# Altium schematic sheet mach giua ben trai.SchDoc
size A; SheetNumber: 1; SheetTotal: 1
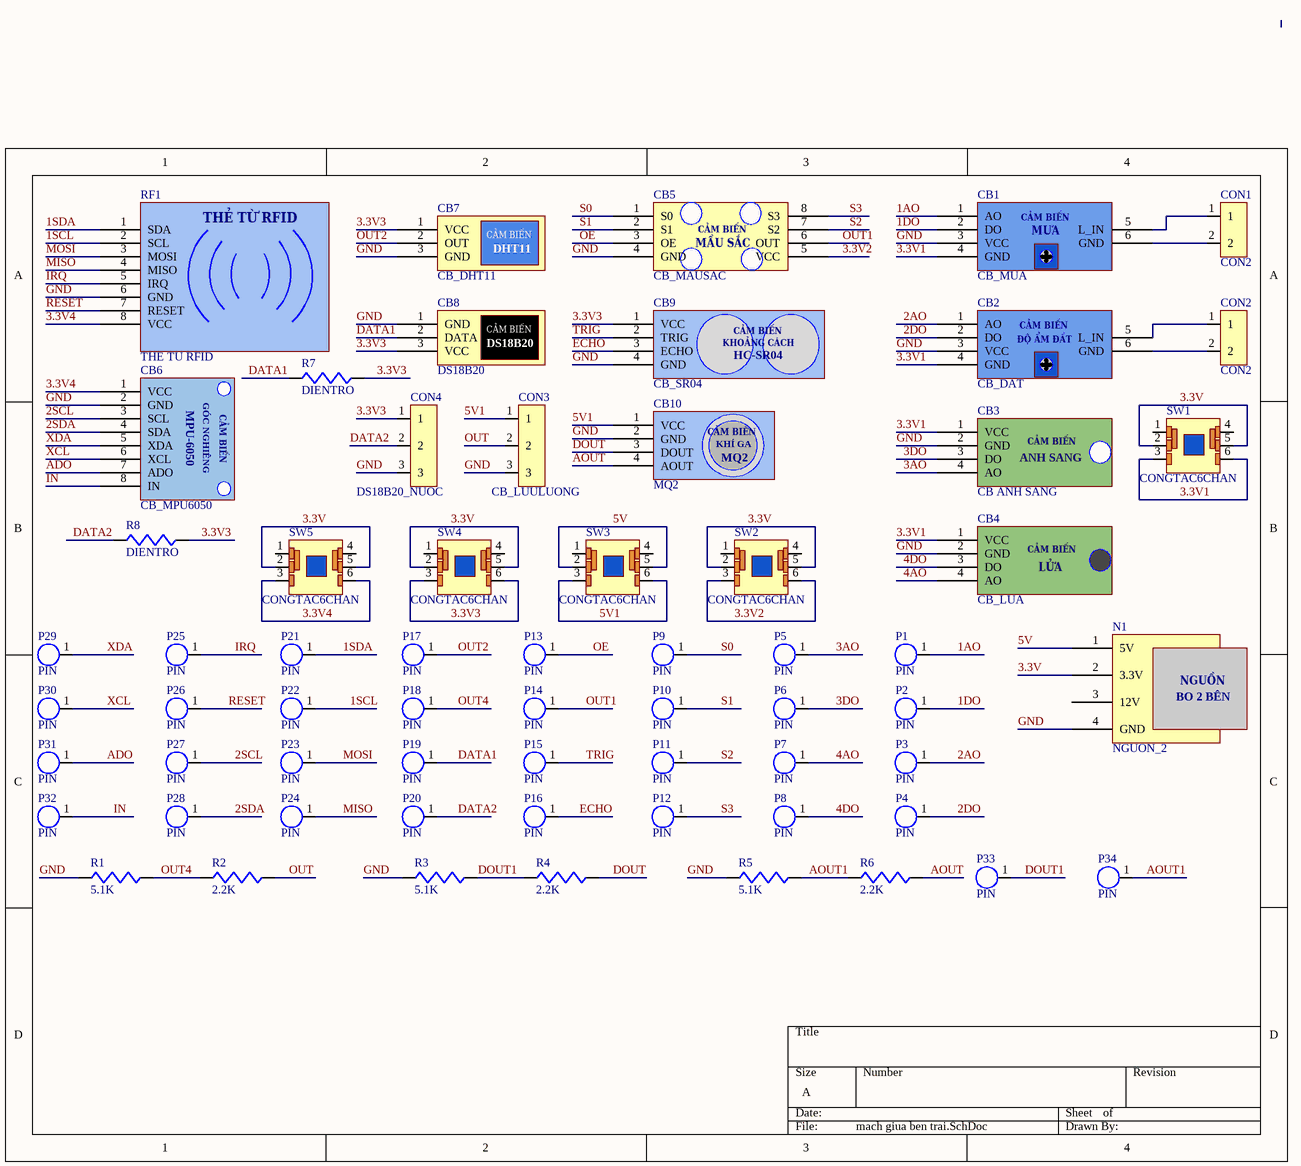
[diagram p0: mach giua ben trai.SchDoc]

## Parts
CB1  CB_MUA  [CB_MUA]
CB2  CB_DAT  [CB_MUA]
CB3  CB ANH SANG  [CB ANH SANG]
CB4  CB_LUA  [CB_LUA]
CB5  CB_MAUSAC  [CB_MAUSAC]
CB6  CB_MPU6050  [CB_MPU6050]
CB7  CB_DHT11  [CB_DHT11]
CB8  DS18B20  [DS18B20]
CB9  CB_SR04  [CB_SR04]
CB10  MQ2  [MQ2]
CON1  CON2  [CON2]
CON2  CON2  [CON2]
CON3  CB_LUULUONG  [CON3]
CON4  DS18B20_NUOC  [CON3]
N1  NGUON_2  [NGUON_2]
P1  PIN  [PIN1]
P2  PIN  [PIN1]
P3  PIN  [PIN1]
P4  PIN  [PIN1]
P5  PIN  [PIN1]
P6  PIN  [PIN1]
P7  PIN  [PIN1]
P8  PIN  [PIN1]
P9  PIN  [PIN1]
P10  PIN  [PIN1]
P11  PIN  [PIN1]
P12  PIN  [PIN1]
P13  PIN  [PIN1]
P14  PIN  [PIN1]
P15  PIN  [PIN1]
P16  PIN  [PIN1]
P17  PIN  [PIN1]
P18  PIN  [PIN1]
P19  PIN  [PIN1]
P20  PIN  [PIN1]
P21  PIN  [PIN1]
P22  PIN  [PIN1]
P23  PIN  [PIN1]
P24  PIN  [PIN1]
P25  PIN  [PIN1]
P26  PIN  [PIN1]
P27  PIN  [PIN1]
P28  PIN  [PIN1]
P29  PIN  [PIN1]
P30  PIN  [PIN1]
P31  PIN  [PIN1]
P32  PIN  [PIN1]
P33  PIN  [PIN1]
P34  PIN  [PIN1]
R1  5.1K  [DIENTRO]
R2  2.2K  [DIENTRO]
R3  5.1K  [DIENTRO]
R4  2.2K  [DIENTRO]
R5  5.1K  [DIENTRO]
R6  2.2K  [DIENTRO]
R7  DIENTRO  [DIENTRO]
R8  DIENTRO  [DIENTRO]
RF1  THE TU RFID  [THE TU RFID]
SW1  CONGTAC6CHAN  [CONGTAC6CHAN]
SW2  CONGTAC6CHAN  [CONGTAC6CHAN]
SW3  CONGTAC6CHAN  [CONGTAC6CHAN]
SW4  CONGTAC6CHAN  [CONGTAC6CHAN]
SW5  CONGTAC6CHAN  [CONGTAC6CHAN]

## Nets
1AO: CB1.1(AO) P1.1
1DO: CB1.2(DO) P2.1
1SCL: P22.1 RF1.2(SCL)
1SDA: P21.1 RF1.1(SDA)
2AO: CB2.1(AO) P3.1
2DO: CB2.2(DO) P4.1
2SCL: CB6.3(SCL) P27.1
2SDA: CB6.4(SDA) P28.1
3.3V: N1.2(3.3V) SW1.2 SW1.5 SW2.2 SW2.5 SW4.2 SW4.5 SW5.2 SW5.5
3.3V1: CB1.4(GND) CB2.4(GND) CB3.1(VCC) CB4.1(VCC) SW1.3 SW1.6
3.3V2: CB5.5(VCC) SW2.3 SW2.6
3.3V3: CB7.1(VCC) CB8.3(VCC) CB9.1(VCC) CON4.1 R7.2 R8.2 SW4.3 SW4.6
3.3V4: CB6.1(VCC) RF1.8(VCC) SW5.3 SW5.6
3AO: CB3.4(AO) P5.1
3DO: CB3.3(DO) P6.1
4AO: CB4.4(AO) P7.1
4DO: CB4.3(DO) P8.1
5V: N1.1(5V) SW3.2 SW3.5
5V1: CB10.1(VCC) CON3.1 SW3.3 SW3.6
ADO: CB6.7(ADO) P31.1
AOUT: CB10.4(AOUT) R6.2
AOUT1: P34.1 R5.2 R6.1
DATA1: CB8.2(DATA) P19.1 R7.1
DATA2: CON4.2 P20.1 R8.1
DOUT: CB10.3(DOUT) R4.2
DOUT1: P33.1 R3.2 R4.1
ECHO: CB9.3(ECHO) P16.1
GND: CB1.3(VCC) CB2.3(VCC) CB3.2(GND) CB4.2(GND) CB5.4(GND) CB6.2(GND) CB7.3(GND) CB8.1(GND) CB9.4(GND) CB10.2(GND) CON3.3 CON4.3 N1.4(GND) R1.1 R3.1 R5.1 RF1.6(GND)
IN: CB6.8(IN) P32.1
IRQ: P25.1 RF1.5(IRQ)
MISO: P24.1 RF1.4(MISO)
MOSI: P23.1 RF1.3(MOSI)
OE: CB5.3(OE) P13.1
OUT: CON3.2 R2.2
OUT1: CB5.6(OUT) P14.1
OUT2: CB7.2(OUT) P17.1
OUT4: P18.1 R1.2 R2.1
RESET: P26.1 RF1.7(RESET)
S0: CB5.1(S0) P9.1
S1: CB5.2(S1) P10.1
S2: CB5.7(S2) P11.1
S3: CB5.8(S3) P12.1
TRIG: CB9.2(TRIG) P15.1
XCL: CB6.6(XCL) P30.1
XDA: CB6.5(XDA) P29.1
NetCB1_5: CB1.5(L_IN) CON1.1
NetCB1_6: CB1.6(GND) CON1.2
NetCB2_5: CB2.5(L_IN) CON2.1
NetCB2_6: CB2.6(GND) CON2.2

Not connected (* = marked no-connect by the designer): N1 3(12V); SW1 1 4; SW2 1 4; SW3 1 4; SW4 1 4; SW5 1 4

## Notes on the sheet
- (in symbol CB ANH SANG) CẢM BIẾN; ANH SANG
- (in symbol CB_DAT) CẢM BIẾN; ĐỘ ẨM ĐẤT
- (in symbol CB_DHT11) CẢM BIẾN; DHT11
- (in symbol CB_LUA) CẢM BIẾN; LỬA
- (in symbol CB_MAUSAC) CẢM BIẾN; MẦU SẮC
- (in symbol CB_MPU6050) GÓC NGHIÊNG; MPU-6050; CẢM BIẾN
- (in symbol CB_MUA) CẢM BIẾN; MƯA
- (in symbol CB_SR04) CẢM BIẾN; KHOẢNG CÁCH; HC-SR04
- (in symbol DS18B20) CẢM BIẾN
- (in symbol MQ2) CẢM BIẾN; KHÍ GA
- (in symbol NGUON_2) NGUỒN; BO 2 BÊN
- (in symbol THE TU RFID) THẺ TỪ RFID

## Library data of the parts
CON3 CON4 = CON3
R1-R6 = DIENTRO